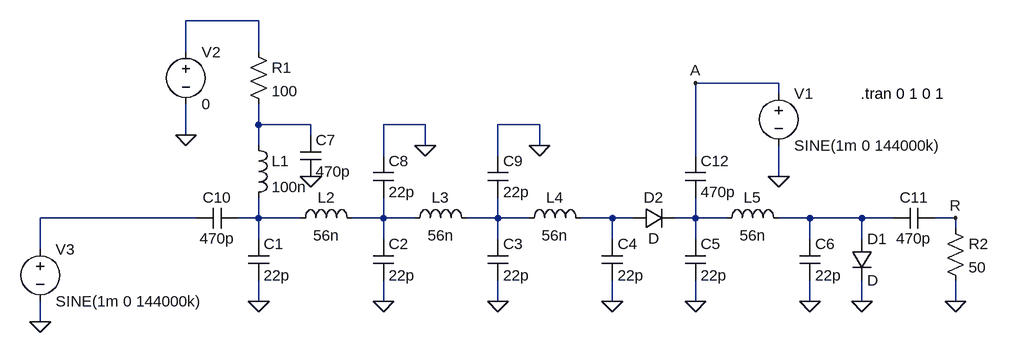
[diagram p0: schematic ece522p2.default.asc]
ece522p2.default.asc, the LTspice schematic file:
Version 4
SHEET 1 984 680
WIRE -144 16 -256 16
WIRE -256 64 -256 16
WIRE -144 64 -144 16
WIRE 656 112 528 112
WIRE 656 128 656 112
WIRE -144 176 -144 144
WIRE -64 176 -144 176
WIRE 112 176 48 176
WIRE 288 176 224 176
WIRE -256 192 -256 144
WIRE -64 192 -64 176
WIRE -144 208 -144 176
WIRE 112 208 112 176
WIRE 288 208 288 176
WIRE 48 224 48 176
WIRE 224 224 224 176
WIRE 528 224 528 112
WIRE 656 256 656 208
WIRE -240 320 -480 320
WIRE -144 320 -144 288
WIRE -144 320 -176 320
WIRE -80 320 -144 320
WIRE 48 320 48 288
WIRE 48 320 0 320
WIRE 96 320 48 320
WIRE 224 320 224 288
WIRE 224 320 176 320
WIRE 272 320 224 320
WIRE 400 320 352 320
WIRE 432 320 400 320
WIRE 528 320 528 288
WIRE 528 320 496 320
WIRE 576 320 528 320
WIRE 704 320 656 320
WIRE 784 320 704 320
WIRE 832 320 784 320
WIRE 928 320 896 320
WIRE 928 336 928 320
WIRE -144 352 -144 320
WIRE 48 352 48 320
WIRE 224 352 224 320
WIRE 400 352 400 320
WIRE 528 352 528 320
WIRE 704 352 704 320
WIRE 784 352 784 320
WIRE -480 368 -480 320
WIRE -144 448 -144 416
WIRE 48 448 48 416
WIRE 224 448 224 416
WIRE 400 448 400 416
WIRE 528 448 528 416
WIRE 704 448 704 416
WIRE 784 448 784 416
WIRE 928 448 928 416
WIRE -480 480 -480 448
FLAG -144 448 0
FLAG 48 448 0
FLAG 224 448 0
FLAG 400 448 0
FLAG 528 448 0
FLAG 704 448 0
FLAG -64 256 0
FLAG 112 208 0
FLAG 288 208 0
FLAG 656 256 0
FLAG 784 448 0
FLAG 928 448 0
FLAG -256 192 0
FLAG 928 320 R
FLAG 528 112 A
FLAG -480 480 0
SYMBOL res -160 48 R0
SYMATTR InstName R1
SYMATTR Value 100
SYMBOL ind -160 192 R0
SYMATTR InstName L1
SYMATTR Value 100n
SYMBOL cap -160 352 R0
SYMATTR InstName C1
SYMATTR Value 22p
SYMBOL cap 32 352 R0
SYMATTR InstName C2
SYMATTR Value 22p
SYMBOL cap 208 352 R0
SYMATTR InstName C3
SYMATTR Value 22p
SYMBOL cap 384 352 R0
SYMATTR InstName C4
SYMATTR Value 22p
SYMBOL cap 512 352 R0
SYMATTR InstName C5
SYMATTR Value 22p
SYMBOL cap 688 352 R0
SYMATTR InstName C6
SYMATTR Value 22p
SYMBOL cap -80 192 R0
SYMATTR InstName C7
SYMATTR Value 470p
SYMBOL cap 32 224 R0
SYMATTR InstName C8
SYMATTR Value 22p
SYMBOL cap 208 224 R0
SYMATTR InstName C9
SYMATTR Value 22p
SYMBOL cap -176 304 R90
WINDOW 0 0 32 VBottom 2
WINDOW 3 32 32 VTop 2
SYMATTR InstName C10
SYMATTR Value 470p
SYMBOL cap 896 304 R90
WINDOW 0 0 32 VBottom 2
WINDOW 3 32 32 VTop 2
SYMATTR InstName C11
SYMATTR Value 470p
SYMBOL diode 768 352 R0
SYMATTR InstName D1
SYMBOL ind -96 336 R270
WINDOW 0 32 56 VTop 2
WINDOW 3 5 56 VBottom 2
SYMATTR InstName L2
SYMATTR Value 56n
SYMBOL ind 80 336 R270
WINDOW 0 32 56 VTop 2
WINDOW 3 5 56 VBottom 2
SYMATTR InstName L3
SYMATTR Value 56n
SYMBOL ind 256 336 R270
WINDOW 0 32 56 VTop 2
WINDOW 3 5 56 VBottom 2
SYMATTR InstName L4
SYMATTR Value 56n
SYMBOL ind 560 336 R270
WINDOW 0 32 56 VTop 2
WINDOW 3 5 56 VBottom 2
SYMATTR InstName L5
SYMATTR Value 56n
SYMBOL cap 512 224 R0
SYMATTR InstName C12
SYMATTR Value 470p
SYMBOL diode 432 336 R270
WINDOW 0 32 32 VTop 2
WINDOW 3 0 32 VBottom 2
SYMATTR InstName D2
SYMBOL voltage 656 112 R0
WINDOW 123 0 0 Left 0
WINDOW 39 0 0 Left 0
SYMATTR InstName V1
SYMATTR Value SINE(1m 0 144000k)
SYMBOL res 912 320 R0
SYMATTR InstName R2
SYMATTR Value 50
SYMBOL voltage -256 48 R0
WINDOW 123 0 0 Left 0
WINDOW 39 0 0 Left 0
SYMATTR InstName V2
SYMATTR Value 0
SYMBOL voltage -480 352 R0
WINDOW 123 0 0 Left 0
WINDOW 39 0 0 Left 0
SYMATTR InstName V3
SYMATTR Value SINE(1m 0 144000k)
TEXT 782 128 Left 2 !.tran 0 1 0 1

The netlist it stands for:
* ece522p2.default.asc
R1 N001 N002 100
L1 N002 N004 100n
C1 N004 0 22p
C2 N005 0 22p
C3 N006 0 22p
C4 N007 0 22p
C5 N008 0 22p
C6 N009 0 22p
C7 N002 0 470p
C8 0 N005 22p
C9 0 N006 22p
C10 N004 N003 470p
C11 R N009 470p
D1 N009 0 D
L2 N004 N005 56n
L3 N005 N006 56n
L4 N006 N007 56n
L5 N008 N009 56n
C12 A N008 470p
D2 N007 N008 D
V1 A 0 SINE(1m 0 144000k)
R2 R 0 50
V2 N001 0 0
V3 N003 0 SINE(1m 0 144000k)
.model D D
.lib standard.dio
.tran 0 1 0 1
.backanno
.end